# Altium schematic sheet PowerSupplies.SchDoc: PowerSupplies
size A4; Author: Joao Guimaraes; Organization: Altium Limited; Address1: L3, 12a Rodborough Rd; Address2: Frenchs Forest; Address3: NSW; Address4: Australia 2086; Revision: 1.0.0
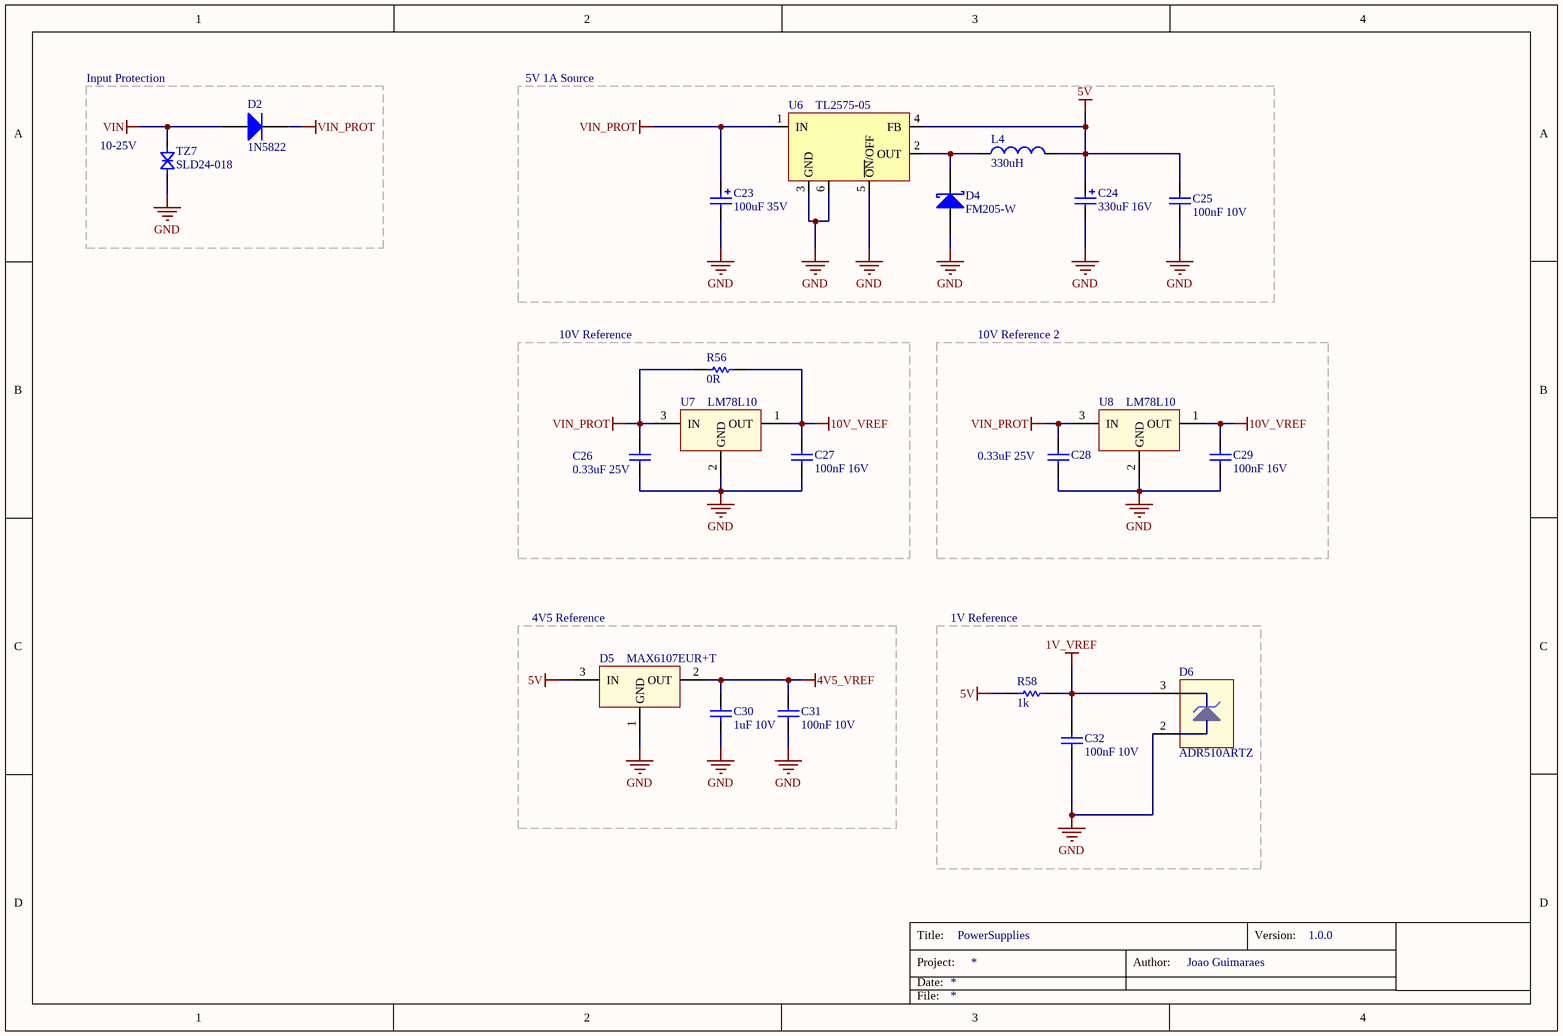
[diagram p0: PowerSupplies.SchDoc]

## Parts
C23  100uF 35V  [WCAP-ASLI_6.3x7.7]
C24  330uF 16V  [WCAP-ASLI_6.3x5.5]
C25  100nF 10V  [C0805]
C26  0.33uF 25V  [C0805]
C27  100nF 16V  [C0805]
C28  0.33uF 25V  [C0805]
C29  100nF 16V  [C0805]
C30  1uF 10V  [C0805]
C31  100nF 10V  [C0805]
C32  100nF 10V  [C0805]
D2  1N5822  [PIN-W2/E2.8]
D4  FM205-W  [DO-214AC]
D5  MAX6107EUR+T  [SOT23_M]
D6  ADR510ARTZ  [SOT23_M]
L4  330uH  [SDE0805A]
R56  0R  [6-0805_M]
R58  1k  [6-0805_M]
TZ7  SLD24-018  [P600]
U6  TL2575-05  [TO-263-5]
U7  LM78L10  [TO-92A]
U8  LM78L10  [TO-92A]

## Blocks framed on the sheet
5V 1A Source: C23-C25 D4 L4 U6
10V Reference: C26 C27 R56 U7
10V Reference 2: C28 C29 U8
4V5 Reference: C30 C31 D5
1V Reference: C32 D6 R58

## Nets
1V_VREF: C32.1 D6.3(K) R58.2
4V5_VREF: C30.1 C31.1 D5.2(OUT)
5V: C24.1 C25.1 D5.3(IN) L4.2 R58.1 U6.4(FB)
10V_VREF: C27.1 C29.1 R56.2 U7.1(OUT) U8.1(OUT)
GND: C23.2 C24.2 C25.2 C26.2 C27.2 C28.2 C29.2 C30.2 C31.2 C32.2 D4.1(A) D5.1(GND) D6.2(A) TZ7.1(A) U6.3(GND) U6.5(~{ON}/OFF) U6.6(GND) U7.2(GND) U8.2(GND)
VIN: D2.1(A) TZ7.2(K)
VIN_PROT: C23.1 C26.1 C28.1 D2.2(K) R56.1 U6.1(IN) U7.3(IN) U8.3(IN)
NetD4_2: D4.2(K) L4.1 U6.2(OUT)

## Notes on the sheet
- Input Protection
- (near TZ7) 10-25V
- Title:
- Project:
- Date:
- Author:
- Version:
- File:

## Library data of the parts
C23 = Cap Pol: Polarized Capacitor (Surface Mount); PartNumber: CAP.100u.35V.20%.SMD.6,3x7,7; Manufacturer: Wurth; ClassName: PowerSupplies; Price: 0.36; Supplier: Mouser
C24 = Cap Pol: Polarized Capacitor (Surface Mount); PartNumber: CAP.330u.6V3.20%.SMD.6,3x5,4; Manufacturer: Wurth; ClassName: PowerSupplies; Price: 0.24; Supplier: Mouser
C25 = Cap: Capacitor; PartNumber: CAP.100n.10V.20%.SMD.0402; Manufacturer: Wurth; ClassName: PowerSupplies; Price: 0.015; Supplier: Mouser
C26 C28 = Cap: Capacitor; PartNumber: CAP.0.33u.25V.10%.SMD.0805; Manufacturer: Vishay; ClassName: PowerSupplies; Price: 0.11; Supplier: Mouser
C27 = Cap: Capacitor; PartNumber: CAP.100n.16V.10%.SMD.0402; Manufacturer: Wurth; ClassName: PowerSupplies; Price: 0.015; Supplier: Mouser
C29 = Cap: Capacitor; PartNumber: CAP.100n.16V.10%.SMD.0805; Manufacturer: Wurth; ClassName: PowerSupplies; Price: 0.015; Supplier: Mouser
C30-C32 = Cap: Capacitor; PartNumber: CAP.1u.10V.10%.SMD.0805; Manufacturer: Vishay; ClassName: PowerSupplies; Price: 0.17; Supplier: Mouser
D2 = Diode: Default Diode; Manufacturer: STMicroelectronics; ClassName: PowerSupplies; PartNumber: 1N5822; Price: 0.47; Supplier: Mouser
D4 = FM5819-W: Schottky Diodes & Rectifiers Vr/40V Io/2A T/R; pin to pad: 1>A 2>C; Manufacturer: Rectron; ClassName: PowerSupplies; PartNumber: FM205-W; Price: 0.15; Supplier: Mouser
D5 = MAX6107EUR+T: 4V5 Voltage References uPower Low-Dropout Voltage Ref; Manufacturer: Maxim Integrated; ClassName: PowerSupplies; PartNumber: MAX6107EUR; Price: 1.14; Supplier: Mouser
D6 = ADR510ARTZ-REEL7: Voltage References 1.0V Prec Shunt Low Noise; Manufacturer: Analog Devices; ClassName: PowerSupplies; PartNumber: ADR510ARTZ; Price: 1.48; Supplier: Mouser
L4 = Inductor: Chip Inductor; PartNumber: SDE0805A-331K; Manufacturer: Bourns; ClassName: PowerSupplies; Price: 0.57; Supplier: Mouser
R56 = Res: Resistor; PartNumber: RES.0R.1/8W.5%.SMD.0805; Manufacturer: Vishay; ClassName: PowerSupplies; Price: 0.044; Supplier: Mouser
R58 = Res: Resistor; PartNumber: RES.1K.1/8W.5%.SMD.0805; Manufacturer: Yageo; ClassName: PowerSupplies; Price: 0.012; Supplier: Mouser
TZ7 = SLD30-018: TVS Bi-Directional VR=30V; Manufacturer: Littelfuse; ClassName: PowerSupplies; PartNumber: SLD24-018; Price: 3.17; Supplier: Mouser
U6 = TL2575-05IKTTR: Switching Voltage Regulators 1-A Step-Down Voltage; Manufacturer: Texas Instruments; ClassName: PowerSupplies; PartNumber: TL2575-05; Price: 2.28; Supplier: Mouser
U7 = LM78L10: 3-TERMINAL 0.1A POSITIVE VOLTAGE REGULATOR; Manufacturer: ON Semiconductor; Price: 0.48; ClassName: PowerSupplies; PartNumber: LM78L10; Supplier: Mouser
U8 = LM78L10: 3-TERMINAL 0.1A POSITIVE VOLTAGE REGULATOR; Price: 0.48; ClassName: PowerSupplies; PartNumber: LM78L10; Supplier: Mouser; Manufacturer: LM78L10